# Altium project NuM487_DEVB.PrjPCB
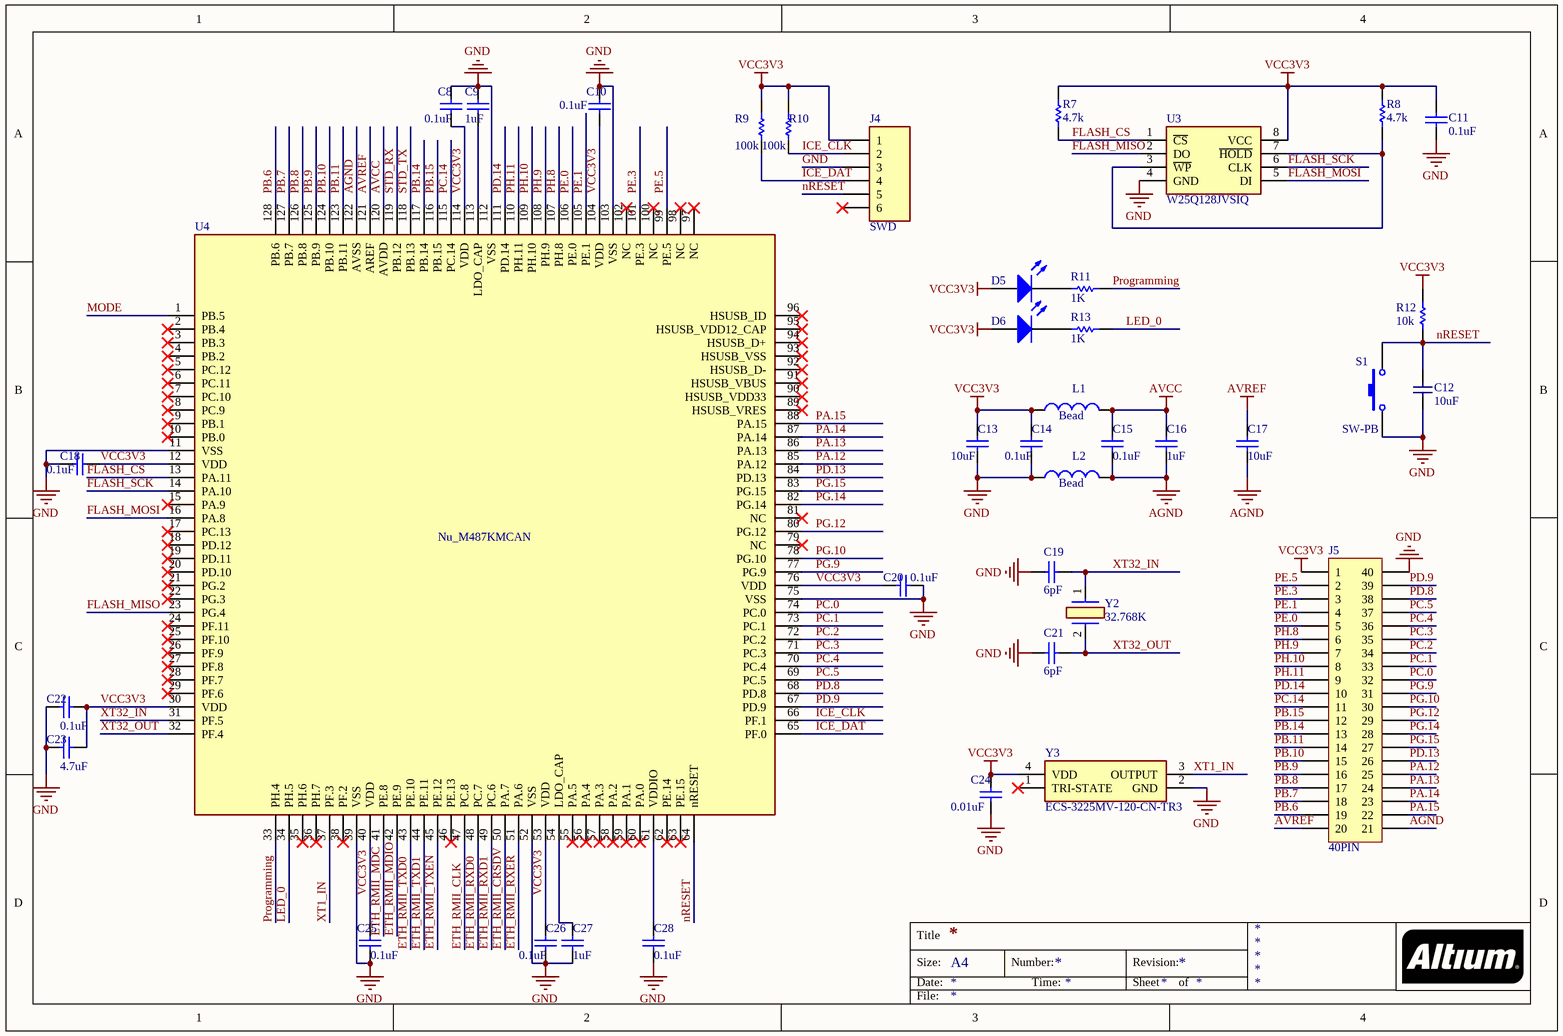
[diagram p0: Main_MCU_NuM487KM.SchDoc]
3 sheets, 96 parts. Net scope: global (net labels, ports and power ports of the same name join across sheets).
Board file: NuM487_DEVB.PcbDoc
Sheets:
  Main_MCU_NuM487KM.SchDoc
  Aux_MCU_ATmega16U4.SchDoc
  NIC_DP83848.SchDoc

## Sheet Main_MCU_NuM487KM.SchDoc
size A4

### Parts
C8  0.1uF  [SMD0603]
C9  1uF  [SMD0603]
C10  0.1uF  [SMD0603]
C11  0.1uF  [SMD0603]
C12  10uF  [SMD0603]
C13  10uF  [SMD0603]
C14  0.1uF  [SMD0603]
C15  0.1uF  [SMD0603]
C16  1uF  [SMD0603]
C17  10uF  [SMD0603]
C18  0.1uF  [SMD0603]
C19  6pF  [SMD0603]
C20  0.1uF  [SMD0603]
C21  6pF  [SMD0603]
C22  0.1uF  [SMD0603]
C23  4.7uF  [SMD0603]
C24  0.01uF  [SMD0603]
C25  0.1uF  [SMD0603]
C26  0.1uF  [SMD0603]
C27  1uF  [SMD0603]
C28  0.1uF  [SMD0603]
D5  LED0  [SMD0603_LED]  (value not drawn)
D6  LED0  [SMD0603_LED]  (value not drawn)
J4  SWD  [ISP]
J5  40PIN  [40PIN]
L1  Bead  [SMD0603]
L2  Bead  [SMD0603]
R7  4.7k  [SMD0603]
R8  4.7k  [SMD0603]
R9  100K  [SMD0603]
R10  100K  [SMD0603]
R11  1K  [SMD0603]
R12  10K  [SMD0603]
R13  1K  [SMD0603]
S1  SW-PB  [Button]
U3  W25Q128JVSIQ  [SOIC127P790X216-8N]
U4  Nu_M487KMCAN  [QFP40P1600X1600X120-128N]
Y2  32.768K  [ECS327634RTR]
Y3  ECS-3225MV-120-CN-TR3  [OSC3225]

### Nets
AGND: C15.2 C16.2 C17.2 J5.21 L2.2 U4.122(AVSS)
AVCC: C15.1 C16.1 L1.2 U4.120(AVDD)
AVREF: C17.1 J5.20 U4.121(AREF)
GND: C8.2 C9.1 C10.2 C11.2 C12.1 C13.2 C14.2 C18.2 C19.2 C20.1 C21.2 C22.2 C23.2 C24.1 C25.1 C26.1 C27.1 C28.1 J4.3 J5.40 L2.1 S1.1 U3.4(GND) U4.11(VSS) U4.39(VSS) U4.52(VSS) U4.75(VSS) U4.103(VSS) U4.112(VSS) Y3.2(GND)
VCC3V3: C8.1 C10.1 C11.1 C13.1 C14.1 C18.1 C20.2 C22.1 C23.1 C24.2 C25.2 C26.2 D5.1(A) D6.1(A) J4.1 J5.1 L1.1 R7.2 R8.2 R9.2 R10.2 R12.2 U3.8(VCC) U4.12(VDD) U4.30(VDD) U4.40(VDD) U4.53(VDD) U4.76(VDD) U4.104(VDD) U4.114(VDD) Y3.4(VDD)
ETH_RMII_CLK: U4.47(PC.8)
ETH_RMII_CRSDV: U4.50(PA.7)
ETH_RMII_MDC: U4.41(PE.8)
ETH_RMII_MDIO: U4.42(PE.9)
ETH_RMII_RXD0: U4.48(PC.7)
ETH_RMII_RXD1: U4.49(PC.6)
ETH_RMII_RXER: U4.51(PA.6)
ETH_RMII_TXD0: U4.43(PE.10)
ETH_RMII_TXD1: U4.44(PE.11)
ETH_RMII_TXEN: U4.45(PE.12)
FLASH_CS: R7.1 U3.1(~{CS}) U4.13(PA.11)
FLASH_MISO: U3.2(DO) U4.23(PG.4)
FLASH_MOSI: U3.5(DI) U4.16(PA.8)
FLASH_SCK: U3.6(CLK) U4.14(PA.10)
ICE_CLK: J4.2 R10.1 U4.66(PF.1)
ICE_DAT: J4.4 R9.1 U4.65(PF.0)
LED_0: R13.1 U4.34(PH.5)
MODE: U4.1(PB.5)
nRESET: C12.2 J4.5 R12.1 S1.2 U4.64(nRESET)
PA.12: J5.25 U4.85(PA.12)
PA.13: J5.24 U4.86(PA.13)
PA.14: J5.23 U4.87(PA.14)
PA.15: J5.22 U4.88(PA.15)
PB.6: J5.19 U4.128(PB.6)
PB.7: J5.18 U4.127(PB.7)
PB.8: J5.17 U4.126(PB.8)
PB.9: J5.16 U4.125(PB.9)
PB.10: J5.15 U4.124(PB.10)
PB.11: J5.14 U4.123(PB.11)
PB.14: J5.13 U4.117(PB.14)
PB.15: J5.12 U4.116(PB.15)
PC.0: J5.32 U4.74(PC.0)
PC.1: J5.33 U4.73(PC.1)
PC.2: J5.34 U4.72(PC.2)
PC.3: J5.35 U4.71(PC.3)
PC.4: J5.36 U4.70(PC.4)
PC.5: J5.37 U4.69(PC.5)
PC.14: J5.11 U4.115(PC.14)
PD.8: J5.38 U4.68(PD.8)
PD.9: J5.39 U4.67(PD.9)
PD.13: J5.26 U4.84(PD.13)
PD.14: J5.10 U4.111(PD.14)
PE.0: J5.5 U4.106(PE.0)
PE.1: J5.4 U4.105(PE.1)
PE.3: J5.3 U4.101(PE.3)
PE.5: J5.2 U4.99(PE.5)
PG.9: J5.31 U4.77(PG.9)
PG.10: J5.30 U4.78(PG.10)
PG.12: J5.29 U4.80(PG.12)
PG.14: J5.28 U4.82(PG.14)
PG.15: J5.27 U4.83(PG.15)
PH.8: J5.6 U4.107(PH.8)
PH.9: J5.7 U4.108(PH.9)
PH.10: J5.8 U4.109(PH.10)
PH.11: J5.9 U4.110(PH.11)
Programming: R11.1 U4.33(PH.4)
STD_RX: U4.119(PB.12)
STD_TX: U4.118(PB.13)
XT1_IN: U4.37(PF.3) Y3.3(OUTPUT)
XT32_IN: C19.1 U4.31(PF.5) Y2.1(OUT/IN)
XT32_OUT: C21.1 U4.32(PF.4) Y2.2(OUT/IN)
NetC9_2: C9.2 U4.113(LDO_CAP)
NetC27_2: C27.2 U4.54(LDO_CAP)
NetC28_2: C28.2 U4.61(VDDIO)
NetD5_2: D5.2(K) R11.2
NetD6_2: D6.2(K) R13.2
NetR8_1: R8.1 U3.3(~{WP}) U3.7(~{HOLD})

Not connected (* = marked no-connect by the designer): J4 6*; U4 2(PB.4)* 3(PB.3)* 4(PB.2)* 5(PC.12)* 6(PC.11)* 7(PC.10)* 8(PC.9)* 9(PB.1)* 10(PB.0)* 15(PA.9)* 17(PC.13)* 18(PD.12)* 19(PD.11)* 20(PD.10)* 21(PG.2)* 22(PG.3)* 24(PF.11)* 25(PF.10)* 26(PF.9)* 27(PF.8)* 28(PF.7)* 29(PF.6)* 35(PH.6)* 36(PH.7)* 38(PF.2)* 46(PE.13)* 55(PA.5)* 56(PA.4)* 57(PA.3)* 58(PA.2)* 59(PA.1)* 60(PA.0)* 62(PE.14)* 63(PE.15)* 79(NC)* 81(NC)* 89(HSUSB_VRES)* 90(HSUSB_VDD33)* 91(HSUSB_VBUS)* 92(HSUSB_D-)* 93(HSUSB_VSS)* 94(HSUSB_D+)* 95(HSUSB_VDD12_CAP)* 96(HSUSB_ID)* 97(NC)* 98(NC)* 100(NC)* 102(NC)*; Y3 1(TRI-STATE)*

### Notes on the sheet
- Title
- Size:
- Date:
- A4
- Number:
- Time:
- Revision:
- Sheet
- of
- File:

### Library data of the parts
C8-C11 C13-C28 = Cap Semi: Capacitor (Semiconductor SIM Model); Published: 8-Jun-2000; LatestRevisionDate: 29-May-2009; LatestRevisionNote: IPC-7351 Footprint Added.; PackageReference: C1206; Publisher: Altium Limited; PackageDescription: Chip Capacitor
  C8 C10 C11 C14 C15 C18 C20 C22 C25 C26 C28: Value: 0.1uF
  C9 C16 C27: Value: 1uF
  C13 C17: Value: 10uF
  C19 C21: Value: 6pF
  C23: Value: 4.7uF
  C24: Value: 0.01uF
C12 = Cap: Capacitor (Semiconductor SIM Model); Value: 10uF
D5 D6 = LED0: Typical INFRARED GaAs LED; Published: 8-Jun-2000; LatestRevisionDate: 08-Jul-2005; LatestRevisionNote: Mech Layer 1 removed.; PackageReference: LED-0; Publisher: Altium Limited; PackageDescription: LED; 2 Leads
J5 = 2x20_header
L1 L2 = Inductor: Code_IEC: 1005; Published: 8-Jun-2000; LatestRevisionDate: 29-May-2009; LatestRevisionNote: IPC-7351 Footprint Added.; PackageReference: 0402-A; Publisher: Altium Limited; PackageDescription: Chip Inductor; Code_JEITA: 0402; Value: Bead
R7-R10 R12 = Res: Semiconductor Resistor
  R7 R8: Value: 4.7k
  R9 R10: Value: 100k
  R12: Value: 10k
R11 R13 = Res Semi: Semiconductor Resistor; Published: 8-Jun-2000; LatestRevisionDate: 17-Jul-2002; LatestRevisionNote: Re-released for DXP Platform.; PackageReference: AXIAL-0.5; Publisher: Altium Limited; PackageDescription: Axial Device, Thru-Hole; 2 Leads; 0.5 in Pin Spacing; Value: 1K
S1 = SW-PB: Switch; Published: 24-Mar-1999; LatestRevisionDate: 17-Jul-2002; LatestRevisionNote: Re-released for DXP Platform.; PackageReference: SPST-2; Publisher: Altium Limited; PackageDescription: Switch; 2 Leads
U3 = W25Q128JVSIQ: Integrated Circuit; Manufacturer_Name: Winbond; Datasheet Link: https://componentsearchengine.com//W25Q128JVSIQ.pdf; Height: 2.16mm; Mouser2 Part Number: 454-W25Q128JVSIQ; Mouser2 Price/Stock: https://www.mouser.com/Search/Refine.aspx?Keyword=454-W25Q128JVSIQ; Manufacturer_Part_Number: W25Q128JVSIQ
U4 = Nu_M487KMCAN: Integrated Circuit
Y2 = ECS-.327-6-34R-TR: Crystal or Oscillator; Manufacturer_Name: ECS; Datasheet Link: https://ecsxtal.com/store/pdf/ECX_34R.pdf; Height: 0.9mm; Manufacturer_Part_Number: ECS-.327-6-34R-TR
Y3 = ECS-3225MV-120-CN-TR3: Crystal or Oscillator; Manufacturer_Name: ECS; Datasheet Link: https://ecsxtal.com/store/pdf/ECS-3225MV.pdf; Height: 1.2mm; Manufacturer_Part_Number: ECS-3225MV-120-CN-TR3

## Sheet Aux_MCU_ATmega16U4.SchDoc
size A4
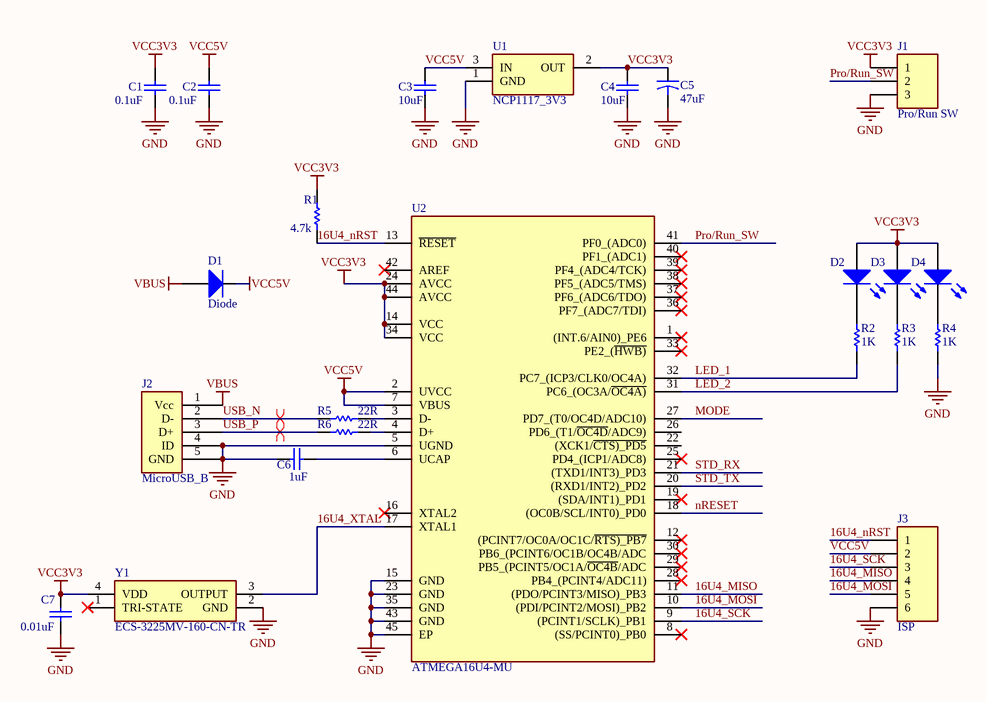
[diagram p1: Aux_MCU_ATmega16U4.SchDoc]

### Parts
C1  0.1uF  [SMD0603]
C2  0.1uF  [SMD0603]
C3  10uF  [SMD0603]
C4  10uF  [SMD0603]
C5  47uF  [TAJ_CLASS_C]
C6  1uF  [SMD0603]
C7  0.01uF  [SMD0603]
D1  Diode  [SMB_DIODE_B130LB]
D2  LED0  [SMD0603_LED]  (value not drawn)
D3  LED0  [SMD0603_LED]  (value not drawn)
D4  LED0  [SMD0603_LED]  (value not drawn)
J1  Pro/Run SW  [SLIDE_SW_3P]
J2  MicroUSB_B  [micro_usb_molex_105017-0001]
J3  ISP  [ISP]
R1  4.7K  [SMD0603]
R2  1K  [SMD0603]
R3  1K  [SMD0603]
R4  1K  [SMD0603]
R5  22R  [SMD0603]
R6  22R  [SMD0603]
U1  NCP1117_3V3  [SOT-223-2]
U2  ATMEGA16U4-MU  [QFN50P700X700X100-45N-D]
Y1  ECS-3225MV-160-CN-TR  [OSC3225]

### Nets
GND: C1.2 C2.2 C3.1 C4.1 C5.2 C6.1 C7.1 J1.3 J2.4(ID) J2.5(GND) J3.6 R4.1 U1.1(GND) U2.5(UGND) U2.15(GND) U2.23(GND) U2.35(GND) U2.43(GND) U2.45(EP) Y1.2(GND)
VBUS: D1.1(A) J2.1(Vcc)
VCC3V3: C1.1 C4.2 C5.1 C7.2 D2.1(A) D3.1(A) D4.1(A) J1.1 R1.2 U1.2(OUT) U2.14(VCC) U2.24(AVCC) U2.34(VCC) U2.44(AVCC) Y1.4(VDD)
VCC5V: C2.1 C3.2 D1.2(K) J3.2 U1.3(IN) U2.2(UVCC) U2.7(VBUS)
16U4_MISO: J3.4 U2.11((PDO/PCINT3/MISO)_PB3)
16U4_MOSI: J3.5 U2.10((PDI/PCINT2/MOSI)_PB2)
16U4_nRST: J3.1 R1.1 U2.13(~{RESET})
16U4_SCK: J3.3 U2.9((PCINT1/SCLK)_PB1)
16U4_XTAL: U2.17(XTAL1) Y1.3(OUTPUT)
LED_1: R2.1 U2.32(PC7_(ICP3/CLK0/OC4A))
LED_2: R3.1 U2.31(PC6_(OC3A/~{OC4A)})
MODE: U2.27(PD7_(T0/OC4D/ADC10))
nRESET: U2.18((OC0B/SCL/INT0)_PD0)
Pro/Run_SW: J1.2 U2.41(PF0_(ADC0))
STD_RX: U2.21((TXD1/INT3)_PD3)
STD_TX: U2.20((RXD1/INT2)_PD2)
USB_N: J2.2(D-) R5.2
USB_P: J2.3(D+) R6.2
NetC6_2: C6.2 U2.6(UCAP)
NetD2_2: D2.2(K) R2.2
NetD3_2: D3.2(K) R3.2
NetD4_2: D4.2(K) R4.2
NetR5_1: R5.1 U2.3(D-)
NetR6_1: R6.1 U2.4(D+)

Not connected (* = marked no-connect by the designer): U2 1((INT.6/AIN0)_PE6)* 8((SS/PCINT0)_PB0)* 12((PCINT7/OC0A/OC1C/~{RTS)_PB7})* 16(XTAL2)* 19((SDA/INT1)_PD1)* 22((XCK1/~{CTS)_PD5}) 25(PD4_(ICP1/ADC8))* 26(PD6_(T1/~{OC4D}/ADC9)) 28(PB4_(PCINT4/ADC11))* 29(PB5_(PCINT5/OC1A/~{OC4B}/ADC)* 30(PB6_(PCINT6/OC1B/OC4B/ADC)* 33(PE2_(~{HWB)})* 36(PF7_(ADC7/TDI))* 37(PF6_(ADC6/TDO))* 38(PF5_(ADC5/TMS))* 39(PF4_(ADC4/TCK))* 40(PF1_(ADC1))* 42(AREF)*; Y1 1(TRI-STATE)*

### Layout directives
differential pair: USB_N, USB_P

### Notes on the sheet
- Title
- Size:
- Date:
- A4
- Number:
- Time:
- Revision:
- Sheet
- of
- File:

### Library data of the parts
C1-C4 C6 C7 = Cap Semi: Capacitor (Semiconductor SIM Model); Published: 8-Jun-2000; LatestRevisionDate: 29-May-2009; LatestRevisionNote: IPC-7351 Footprint Added.; PackageReference: C1206; Publisher: Altium Limited; PackageDescription: Chip Capacitor
  C1 C2: Value: 0.1uF
  C3 C4: Value: 10uF
  C6: Value: 1uF
  C7: Value: 0.01uF
C5 = Cap2: Capacitor; Published: 23-Sep-2002; PackageReference: CAPR5-4X5; Publisher: Altium Limited; Value: 47uF
D1 = Diode: Default Diode; Published: 8-Jun-2000; LatestRevisionDate: 17-Jul-2002; LatestRevisionNote: Re-released for DXP Platform.; PackageVersion: Sep-1996; PackageReference: SMC; Publisher: Altium Limited; PackageDescription: DO-214-AB/SMC; 2 C-Bend Leads; Body 7.9 x 5.9 mm, inc. leads (LxW); Code_JEDEC: DO-214-AB
D2-D4 = LED0: Typical INFRARED GaAs LED; Published: 8-Jun-2000; LatestRevisionDate: 08-Jul-2005; LatestRevisionNote: Mech Layer 1 removed.; PackageReference: LED-0; Publisher: Altium Limited; PackageDescription: LED; 2 Leads
J1 = Pro/Run SW: Program/Run Switch
R1 R5 R6 = Res: Semiconductor Resistor
  R1: Value: 4.7k
  R5 R6: Value: 22R
R2-R4 = Res Semi: Semiconductor Resistor; Published: 8-Jun-2000; LatestRevisionDate: 17-Jul-2002; LatestRevisionNote: Re-released for DXP Platform.; PackageReference: AXIAL-0.5; Publisher: Altium Limited; PackageDescription: Axial Device, Thru-Hole; 2 Leads; 0.5 in Pin Spacing; Value: 1K
U1 = NCP1117_3V3: IC REG 3.3V 1A DPAC
U2 = ATMEGA16U4-MU: Integrated Circuit; Manufacturer_Name: Microchip; Datasheet Link: http://ww1.microchip.com/downloads/en/DeviceDoc/Atmel-7766-8-bit-AVR-ATmega16U4-32U4_Summary.pdf; Height: 1mm; Manufacturer_Part_Number: ATMEGA16U4-MU
Y1 = ECS-3225MV-160-CN-TR: Crystal or Oscillator; Manufacturer_Name: ECS; Datasheet Link: https://componentsearchengine.com//ECS-3225MV-160-CN-TR.pdf; Height: 1.2mm; Mouser2 Part Number: 520-3225MV-160-CNT; Mouser2 Price/Stock: https://www.mouser.com/Search/Refine.aspx?Keyword=520-3225MV-160-CNT; Manufacturer_Part_Number: ECS-3225MV-160-CN-TR

## Sheet NIC_DP83848.SchDoc
size A4
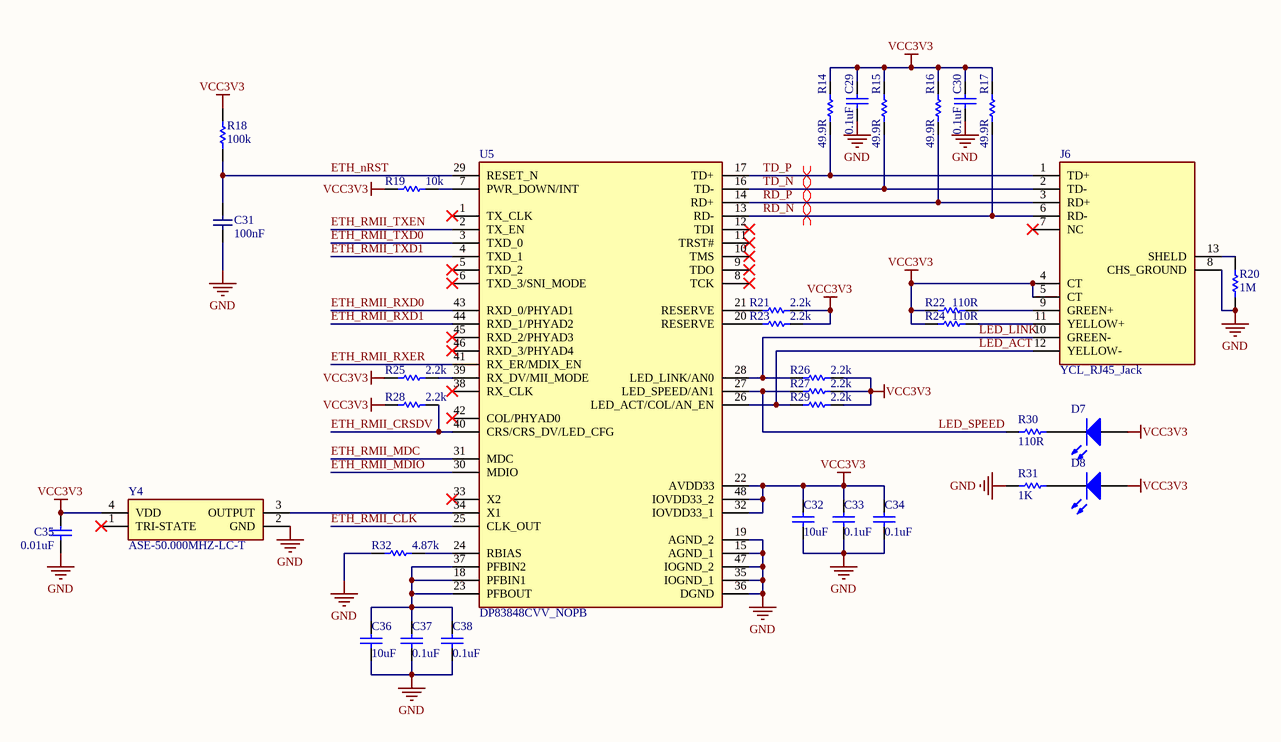
[diagram p2: NIC_DP83848.SchDoc]

### Parts
C29  0.1uF  [SMD0603]
C30  0.1uF  [SMD0603]
C31  100nF  [SMD0603]
C32  10uF  [SMD0603]
C33  0.1uF  [SMD0603]
C34  0.1uF  [SMD0603]
C35  value 0.01uF  [SMD0603]  (hidden comment: 0.1uF)
C36  10uF  [SMD0603]
C37  0.1uF  [SMD0603]
C38  0.1uF  [SMD0603]
D7  LED0  [SMD0603_LED]  (value not drawn)
D8  LED0  [SMD0603_LED]  (value not drawn)
J6  YCL_RJ45_Jack  [YCL_RJ45_Jack]
R14  49.9R  [SMD0603]
R15  49.9R  [SMD0603]
R16  49.9R  [SMD0603]
R17  49.9R  [SMD0603]
R18  100K  [SMD0603]
R19  10k  [SMD0603]
R20  1M  [SMD0603]
R21  2.2k  [SMD0603]
R22  110R  [SMD0603]
R23  2.2k  [SMD0603]
R24  110R  [SMD0603]
R25  2.2k  [SMD0603]
R26  2.2k  [SMD0603]
R27  2.2k  [SMD0603]
R28  2.2k  [SMD0603]
R29  2.2k  [SMD0603]
R30  value 110R  [SMD0603]  (hidden comment: 1K)
R31  1K  [SMD0603]
R32  4.87k  [SMD0603]
U5  DP83848CVV_NOPB  [QFP50P900X900X160-48N]
Y4  ASE-50.000MHZ-LC-T  [OSC3225]

### Nets
GND: C29.2 C30.2 C31.1 C32.2 C33.2 C34.2 C35.2 C36.2 C37.2 C38.2 J6.8(CHS_GROUND) R20.1 R31.1 R32.2 U5.15(AGND_1) U5.19(AGND_2) U5.35(IOGND_1) U5.36(DGND) U5.47(IOGND_2) Y4.2(GND)
VCC3V3: C29.1 C30.1 C32.1 C33.1 C34.1 C35.1 D7.1(A) D8.1(A) J6.4(CT) J6.5(CT) R14.1 R15.1 R16.1 R17.1 R18.2 R19.2 R21.1 R22.1 R23.2 R24.1 R25.2 R26.1 R27.2 R28.2 R29.1 U5.22(AVDD33) U5.32(IOVDD33_1) U5.48(IOVDD33_2) Y4.4(VDD)
ETH_nRST: C31.2 R18.1 U5.29(RESET_N)
ETH_RMII_CLK: U5.25(CLK_OUT)
ETH_RMII_CRSDV: R28.1 U5.40(CRS/CRS_DV/LED_CFG)
ETH_RMII_MDC: U5.31(MDC)
ETH_RMII_MDIO: U5.30(MDIO)
ETH_RMII_RXD0: U5.43(RXD_0/PHYAD1)
ETH_RMII_RXD1: U5.44(RXD_1/PHYAD2)
ETH_RMII_RXER: U5.41(RX_ER/MDIX_EN)
ETH_RMII_TXD0: U5.3(TXD_0)
ETH_RMII_TXD1: U5.4(TXD_1)
ETH_RMII_TXEN: U5.2(TX_EN)
LED_ACT: J6.12(YELLOW-) R29.2 U5.26(LED_ACT/COL/AN_EN)
LED_LINK: J6.10(GREEN-) R26.2 U5.28(LED_LINK/AN0)
LED_SPEED: R27.1 R30.1 U5.27(LED_SPEED/AN1)
RD_N: J6.6(RD-) R17.2 U5.13(RD-)
RD_P: J6.3(RD+) R16.2 U5.14(RD+)
TD_N: J6.2(TD-) R15.2 U5.16(TD-)
TD_P: J6.1(TD+) R14.2 U5.17(TD+)
NetC36_1: C36.1 C37.1 C38.1 U5.18(PFBIN1) U5.23(PFBOUT) U5.37(PFBIN2)
NetD7_2: D7.2(K) R30.2
NetD8_2: D8.2(K) R31.2
NetJ6_9: J6.9(GREEN+) R22.2
NetJ6_11: J6.11(YELLOW+) R24.2
NetJ6_13: J6.13(SHELD) R20.2
NetR19_1: R19.1 U5.7(PWR_DOWN/INT)
NetR21_2: R21.2 U5.21(RESERVE)
NetR23_1: R23.1 U5.20(RESERVE)
NetR25_1: R25.1 U5.39(RX_DV/MII_MODE)
NetR32_1: R32.1 U5.24(RBIAS)
NetU5_34: U5.34(X1) Y4.3(OUTPUT)

Not connected (* = marked no-connect by the designer): J6 7(NC)*; U5 1(TX_CLK)* 5(TXD_2)* 6(TXD_3/SNI_MODE)* 8(TCK)* 9(TDO)* 10(TMS)* 11(TRST#)* 12(TDI)* 33(X2)* 38(RX_CLK)* 42(COL/PHYAD0)* 45(RXD_2/PHYAD3)* 46(RXD_3/PHYAD4)*; Y4 1(TRI-STATE)*

### Layout directives
differential pair: RD_N, RD_P, TD_N, TD_P

### Notes on the sheet
- Title
- Size:
- Date:
- A4
- Number:
- Time:
- Revision:
- Sheet
- of
- File:

### Library data of the parts
C29 C30 C32-C38 = Cap Semi: Capacitor (Semiconductor SIM Model); Published: 8-Jun-2000; LatestRevisionDate: 29-May-2009; LatestRevisionNote: IPC-7351 Footprint Added.; PackageReference: C1206; Publisher: Altium Limited; PackageDescription: Chip Capacitor
  C29 C30 C33 C34 C37 C38: Value: 0.1uF
  C32 C36: Value: 10uF
C31 = Cap: Capacitor (Semiconductor SIM Model); Value: 100nF
D7 D8 = LED0: Typical INFRARED GaAs LED; Published: 8-Jun-2000; LatestRevisionDate: 08-Jul-2005; LatestRevisionNote: Mech Layer 1 removed.; PackageReference: LED-0; Publisher: Altium Limited; PackageDescription: LED; 2 Leads
J6 = YCL_RJ45_Jack: Connector; Manufacturer_Name: Pulse; Manufacturer_Part_Number: J0011D21BNL; Datasheet Link: https://www.mouser.de/datasheet/2/336/J403-370307.pdf; Height: 16.39mm
R14-R17 R19-R32 = Res Semi: Semiconductor Resistor; Published: 8-Jun-2000; LatestRevisionDate: 17-Jul-2002; LatestRevisionNote: Re-released for DXP Platform.; PackageReference: AXIAL-0.5; Publisher: Altium Limited; PackageDescription: Axial Device, Thru-Hole; 2 Leads; 0.5 in Pin Spacing
  R14-R17: Value: 49.9R
  R19: Value: 10k
  R20: Value: 1M
  R21 R23 R25-R29: Value: 2.2k
  R22 R24: Value: 110R
  R31: Value: 1K
  R32: Value: 4.87k
R18 = Res: Semiconductor Resistor; Value: 100k
U5 = DP83848CVV: Ethernet phy
Y4 = ASE-50.000MHZ-LC-T: Crystal or Oscillator; Manufacturer_Name: ABRACON; Datasheet Link: https://componentsearchengine.com//ASE-50.000MHZ-LC-T.pdf; Height: 1.2mm; Mouser2 Part Number: 815-ASE50.000MHZLCT; Mouser2 Price/Stock: https://www.mouser.com/Search/Refine.aspx?Keyword=815-ASE50.000MHZLCT; Manufacturer_Part_Number: ASE-50.000MHZ-LC-T

## Nets that join several sheets
GND: Main_MCU_NuM487KM (30 pins), Aux_MCU_ATmega16U4 (20 pins), NIC_DP83848 (20 pins)
VCC3V3: Main_MCU_NuM487KM (31 pins), Aux_MCU_ATmega16U4 (15 pins), NIC_DP83848 (29 pins)
ETH_RMII_CLK: Main_MCU_NuM487KM (U4.47), NIC_DP83848 (U5.25)
ETH_RMII_CRSDV: Main_MCU_NuM487KM (U4.50), NIC_DP83848 (R28.1 U5.40)
ETH_RMII_MDC: Main_MCU_NuM487KM (U4.41), NIC_DP83848 (U5.31)
ETH_RMII_MDIO: Main_MCU_NuM487KM (U4.42), NIC_DP83848 (U5.30)
ETH_RMII_RXD0: Main_MCU_NuM487KM (U4.48), NIC_DP83848 (U5.43)
ETH_RMII_RXD1: Main_MCU_NuM487KM (U4.49), NIC_DP83848 (U5.44)
ETH_RMII_RXER: Main_MCU_NuM487KM (U4.51), NIC_DP83848 (U5.41)
ETH_RMII_TXD0: Main_MCU_NuM487KM (U4.43), NIC_DP83848 (U5.3)
ETH_RMII_TXD1: Main_MCU_NuM487KM (U4.44), NIC_DP83848 (U5.4)
ETH_RMII_TXEN: Main_MCU_NuM487KM (U4.45), NIC_DP83848 (U5.2)
MODE: Main_MCU_NuM487KM (U4.1), Aux_MCU_ATmega16U4 (U2.27)
nRESET: Main_MCU_NuM487KM (5 pins), Aux_MCU_ATmega16U4 (U2.18)
STD_RX: Main_MCU_NuM487KM (U4.119), Aux_MCU_ATmega16U4 (U2.21)
STD_TX: Main_MCU_NuM487KM (U4.118), Aux_MCU_ATmega16U4 (U2.20)